# Altium schematic sheet Node.SchDoc
size A
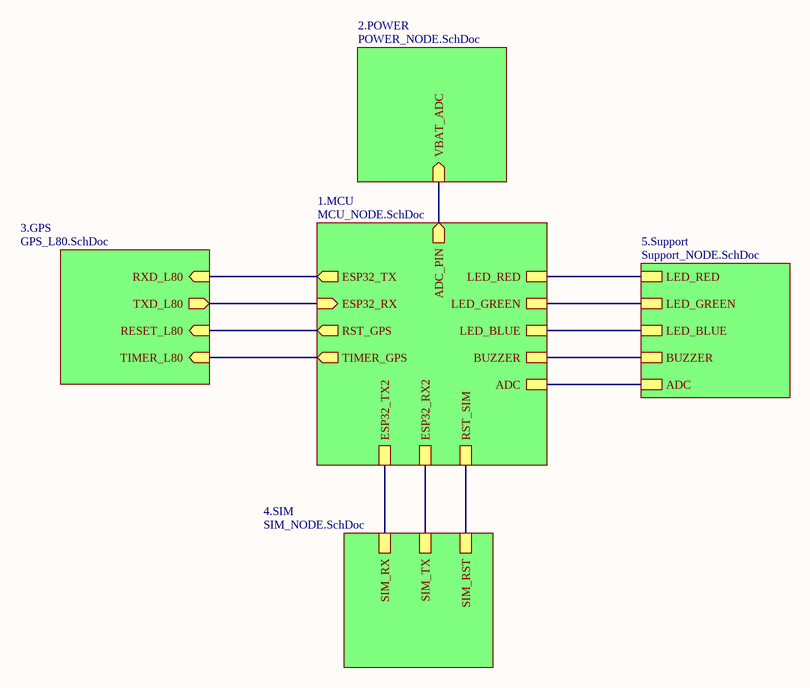
[diagram p0: Node.SchDoc]

## Sub-sheets
1.MCU = MCU_NODE.SchDoc: ESP32_TX (out), ADC_PIN (out), ESP32_RX (in), RST_GPS (out), TIMER_GPS (out), LED_RED, LED_GREEN, LED_BLUE, BUZZER, ESP32_TX2, ESP32_RX2, RST_SIM, ADC
2.POWER = POWER_NODE.SchDoc: VBAT_ADC (in)
3.GPS = GPS_L80.SchDoc: RXD_L80 (in), TXD_L80 (out), RESET_L80 (in), TIMER_L80 (in)
4.SIM = SIM_NODE.SchDoc: SIM_RX, SIM_TX, SIM_RST
5.Support = Support_NODE.SchDoc: LED_RED, LED_GREEN, LED_BLUE, BUZZER, ADC

## Nets
(unnamed): sheet 1.MCU/ESP32_TX, sheet 3.GPS/RXD_L80
(unnamed): sheet 1.MCU/ADC_PIN, sheet 2.POWER/VBAT_ADC
(unnamed): sheet 1.MCU/ESP32_RX, sheet 3.GPS/TXD_L80
(unnamed): sheet 1.MCU/RST_GPS, sheet 3.GPS/RESET_L80
(unnamed): sheet 1.MCU/TIMER_GPS, sheet 3.GPS/TIMER_L80
(unnamed): sheet 1.MCU/LED_RED, sheet 5.Support/LED_RED
(unnamed): sheet 1.MCU/LED_GREEN, sheet 5.Support/LED_GREEN
(unnamed): sheet 1.MCU/LED_BLUE, sheet 5.Support/LED_BLUE
(unnamed): sheet 1.MCU/BUZZER, sheet 5.Support/BUZZER
(unnamed): sheet 1.MCU/ESP32_TX2, sheet 4.SIM/SIM_RX
(unnamed): sheet 1.MCU/ESP32_RX2, sheet 4.SIM/SIM_TX
(unnamed): sheet 1.MCU/RST_SIM, sheet 4.SIM/SIM_RST
(unnamed): sheet 1.MCU/ADC, sheet 5.Support/ADC